# EAGLE design or-stm32-ds (EAGLE 6.2)
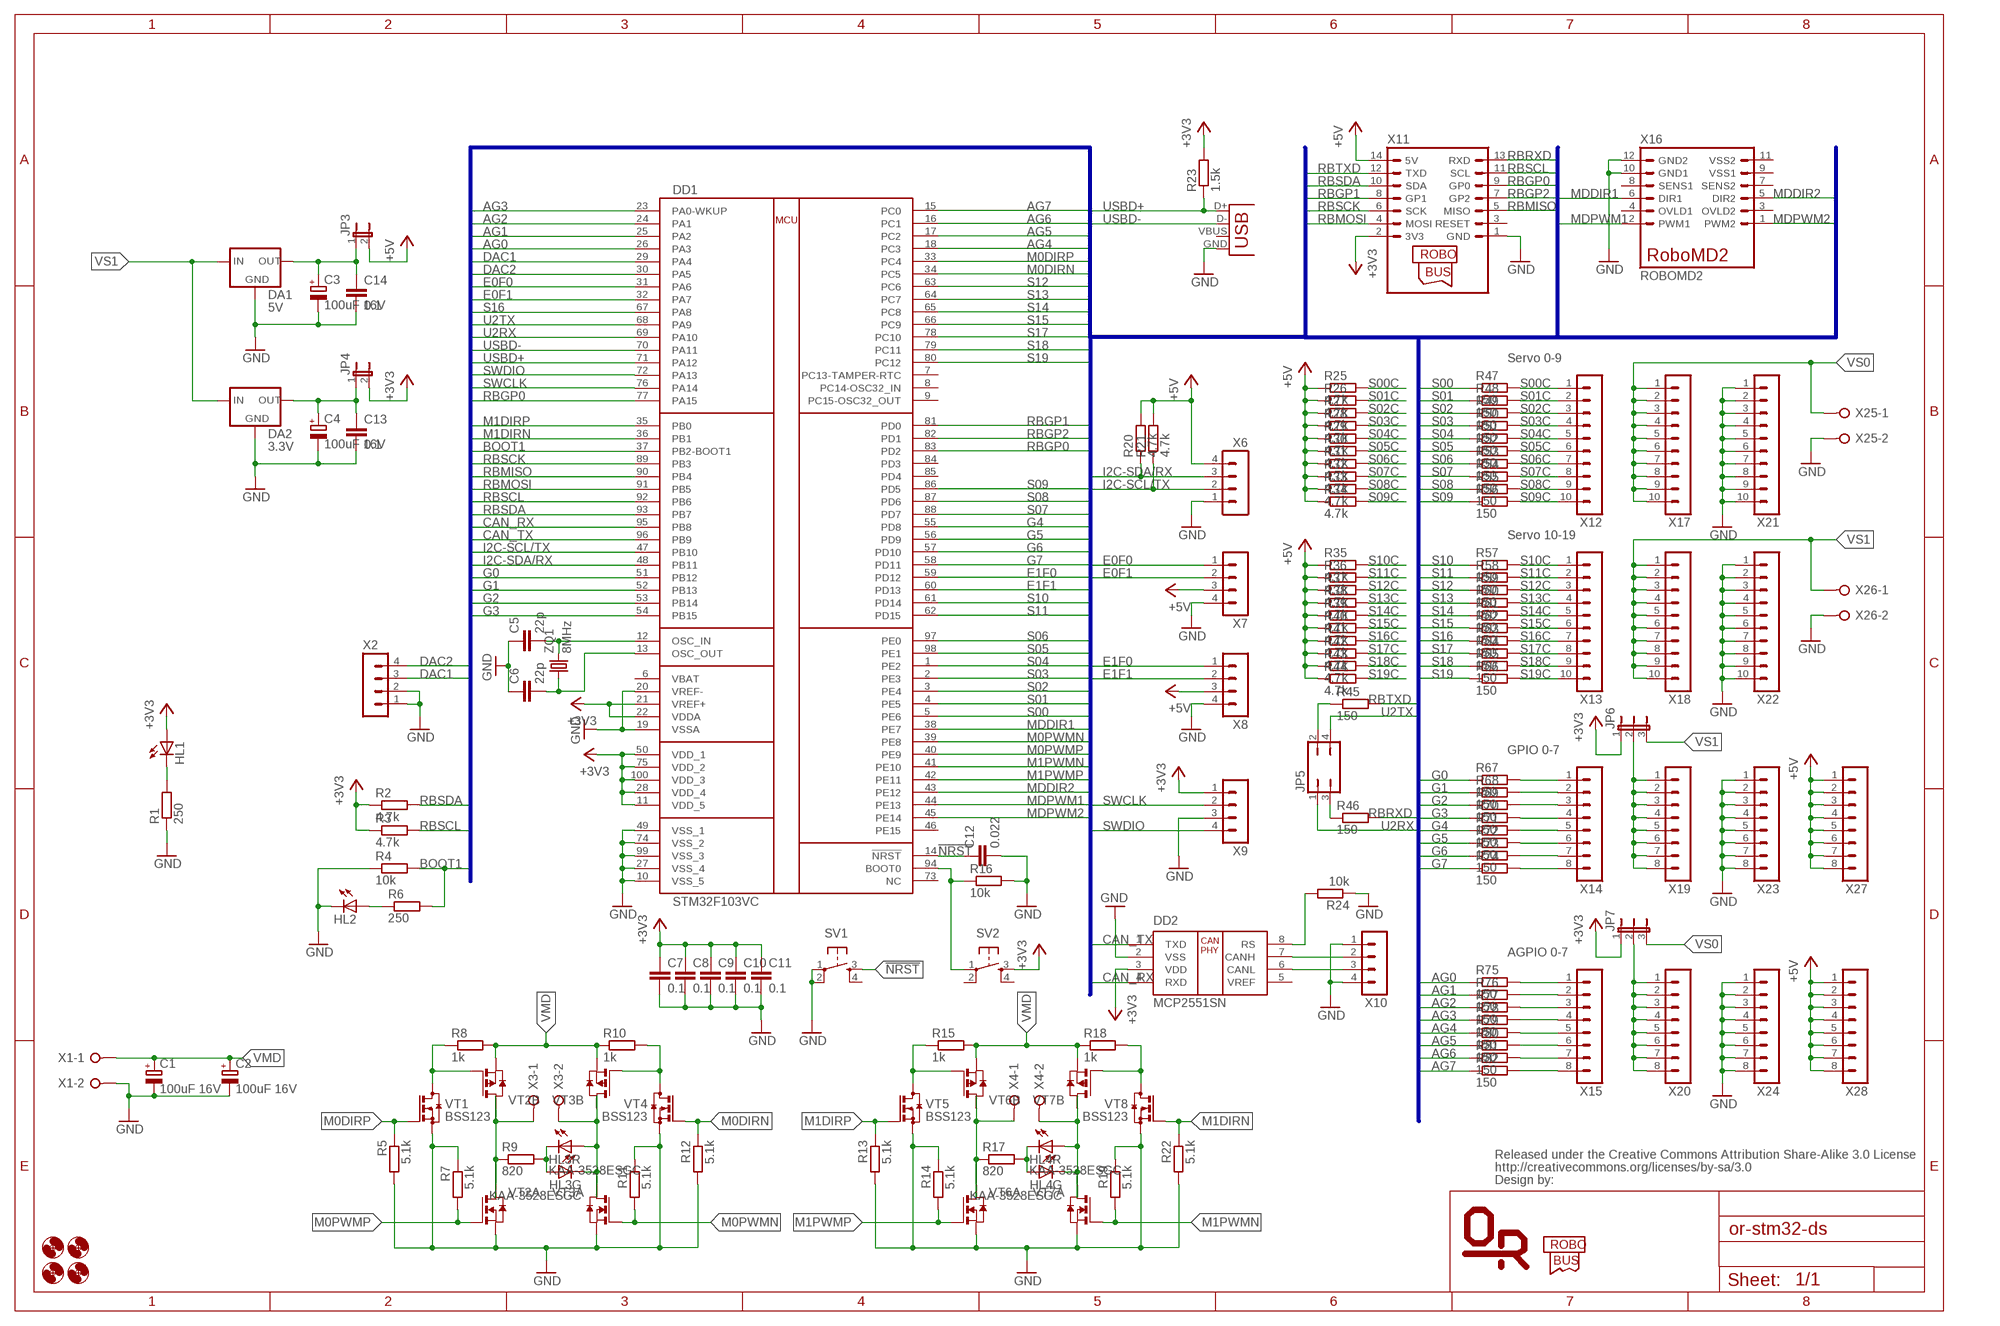
[diagram p0: schematic, sheet 1]

## Parts
C1  100uF 16V  CPOL-EUE3.5-8  [E3,5-8]
C2  100uF 16V  CPOL-EUE3.5-8  [E3,5-8]
C3  100uF 16V  CPOL-EUE3.5-8  [E3,5-8]
C4  100uF 16V  CPOL-EUE3.5-8  [E3,5-8]
C5  22p  C-EUC0603  [C0603]
C6  22p  C-EUC0603  [C0603]
C7  0.1  C-EUC0603  [C0603]
C8  0.1  C-EUC0603  [C0603]
C9  0.1  C-EUC0603  [C0603]
C10  0.1  C-EUC0603  [C0603]
C11  0.1  C-EUC0603  [C0603]
C12  0.022  C-EUC0603  [C0603]
C13  0.1  C-EUC0603  [C0603]
C14  0.1  C-EUC0603  [C0603]
DA1  5V  LM1117  [SOT223]
DA2  3.3V  LM1117  [SOT223]
DD1  STM32F103VC  [LQFP100]
DD2  MCP2551SN  [SO-08]
H1  MOUNT-HOLE3.2  [3,2]
H2  MOUNT-HOLE3.2  [3,2]
H3  MOUNT-HOLE3.2  [3,2]
H4  MOUNT-HOLE3.2  [3,2]
HL1  LEDCHIP-LED0805  [CHIP-LED0805]
HL2  LEDCHIP-LED0805  [CHIP-LED0805]
HL3  KAA-3528ESGC  [KA-3528]
HL4  KAA-3528ESGC  [KA-3528]
JP3  JP1E  [JP1]
JP4  JP1E  [JP1]
JP5  JP2Q  [JP2Q]
JP6  JP2E  [JP2]
JP7  JP2E  [JP2]
R1  250  R-EU_R0603  [R0603]
R2  4.7k  R-EU_R0603  [R0603]
R3  4.7k  R-EU_R0603  [R0603]
R4  10k  R-EU_R0603  [R0603]
R5  5.1k  R-EU_R0603  [R0603]
R6  250  R-EU_R0603  [R0603]
R7  5.1k  R-EU_R0603  [R0603]
R8  1k  R-EU_R0603  [R0603]
R9  820  R-EU_R0603  [R0603]
R10  1k  R-EU_R0603  [R0603]
R11  5.1k  R-EU_R0603  [R0603]
R12  5.1k  R-EU_R0603  [R0603]
R13  5.1k  R-EU_R0603  [R0603]
R14  5.1k  R-EU_R0603  [R0603]
R15  1k  R-EU_R0603  [R0603]
R16  10k  R-EU_R0603  [R0603]
R17  820  R-EU_R0603  [R0603]
R18  1k  R-EU_R0603  [R0603]
R19  5.1k  R-EU_R0603  [R0603]
R20  4.7k  R-EU_R0603  [R0603]
R21  4.7k  R-EU_R0603  [R0603]
R22  5.1k  R-EU_R0603  [R0603]
R23  1.5k  R-EU_R0603  [R0603]
R24  10k  R-EU_R0603  [R0603]
R25  4.7k  R-EU_R0603  [R0603]
R26  4.7k  R-EU_R0603  [R0603]
R27  4.7k  R-EU_R0603  [R0603]
R28  4.7k  R-EU_R0603  [R0603]
R29  4.7k  R-EU_R0603  [R0603]
R30  4.7k  R-EU_R0603  [R0603]
R31  4.7k  R-EU_R0603  [R0603]
R32  4.7k  R-EU_R0603  [R0603]
R33  4.7k  R-EU_R0603  [R0603]
R34  4.7k  R-EU_R0603  [R0603]
R35  4.7k  R-EU_R0603  [R0603]
R36  4.7k  R-EU_R0603  [R0603]
R37  4.7k  R-EU_R0603  [R0603]
R38  4.7k  R-EU_R0603  [R0603]
R39  4.7k  R-EU_R0603  [R0603]
R40  4.7k  R-EU_R0603  [R0603]
R41  4.7k  R-EU_R0603  [R0603]
R42  4.7k  R-EU_R0603  [R0603]
R43  4.7k  R-EU_R0603  [R0603]
R44  4.7k  R-EU_R0603  [R0603]
R45  150  R-EU_R0603  [R0603]
R46  150  R-EU_R0603  [R0603]
R47  150  R-EU_R0603  [R0603]
R48  150  R-EU_R0603  [R0603]
R49  150  R-EU_R0603  [R0603]
R50  150  R-EU_R0603  [R0603]
R51  150  R-EU_R0603  [R0603]
R52  150  R-EU_R0603  [R0603]
R53  150  R-EU_R0603  [R0603]
R54  150  R-EU_R0603  [R0603]
R55  150  R-EU_R0603  [R0603]
R56  150  R-EU_R0603  [R0603]
R57  150  R-EU_R0603  [R0603]
R58  150  R-EU_R0603  [R0603]
R59  150  R-EU_R0603  [R0603]
R60  150  R-EU_R0603  [R0603]
R61  150  R-EU_R0603  [R0603]
R62  150  R-EU_R0603  [R0603]
R63  150  R-EU_R0603  [R0603]
R64  150  R-EU_R0603  [R0603]
R65  150  R-EU_R0603  [R0603]
R66  150  R-EU_R0603  [R0603]
R67  150  R-EU_R0603  [R0603]
R68  150  R-EU_R0603  [R0603]
R69  150  R-EU_R0603  [R0603]
R70  150  R-EU_R0603  [R0603]
R71  150  R-EU_R0603  [R0603]
R72  150  R-EU_R0603  [R0603]
R73  150  R-EU_R0603  [R0603]
R74  150  R-EU_R0603  [R0603]
R75  150  R-EU_R0603  [R0603]
R76  150  R-EU_R0603  [R0603]
R77  150  R-EU_R0603  [R0603]
R78  150  R-EU_R0603  [R0603]
R79  150  R-EU_R0603  [R0603]
R80  150  R-EU_R0603  [R0603]
R81  150  R-EU_R0603  [R0603]
R82  150  R-EU_R0603  [R0603]
SV1  TAC_SWITCHSMD  [TACTILE_SWITCH_SMD]
SV2  TAC_SWITCHSMD  [TACTILE_SWITCH_SMD]
U$1  CREATIVE_COMMONS_BY-SA  [CC-BY-SA-6MM]
U$2  ORLOGO  [ORLOGO]
U$3  ROBOBUS_LOGO  [ROBOBUS_LOGO]
VT1  BSS123  [SOT23]
VT2  PN_MOSFET-SO8  [SO8]
VT3  PN_MOSFET-SO8  [SO8]
VT4  BSS123  [SOT23]
VT5  BSS123  [SOT23]
VT6  PN_MOSFET-SO8  [SO8]
VT7  PN_MOSFET-SO8  [SO8]
VT8  BSS123  [SOT23]
X1  HT396R-02P  [HT396R-02P]
X2  MA04-11.27MM  [1X04-1.27MM]
X3  HT396R-02P  [HT396R-02P]
X4  HT396R-02P  [HT396R-02P]
X5  USBSMD  [USB-MINIB]
X6  MA04-1  [MA04-1]
X7  MA04-1  [MA04-1]
X8  MA04-1  [MA04-1]
X9  MA04-11.27MM  [1X04-1.27MM]
X10  MA04-1  [MA04-1]
X11  ROBOBUSR  [ML14L]
X12  MA10-1  [MA10-1]
X13  MA10-1  [MA10-1]
X14  MA08-1  [MA08-1]
X15  MA08-1  [MA08-1]
X16  ROBOMD2  [ML12]
X17  MA10-1  [MA10-1]
X18  MA10-1  [MA10-1]
X19  MA08-1  [MA08-1]
X20  MA08-1  [MA08-1]
X21  MA10-1  [MA10-1]
X22  MA10-1  [MA10-1]
X23  MA08-1  [MA08-1]
X24  MA08-1  [MA08-1]
X25  W237-02P  [W237-132]
X26  W237-02P  [W237-132]
X27  MA08-1  [MA08-1]
X28  MA08-1  [MA08-1]
ZQ1  8MHz  CRYSTALHC49U-V  [HC49U-V]

## Nets
!NRST: C12.1 DD1.14(!NRST) SV1.3
+3V3: C7.1 C8.1 C9.1 C10.1 C11.1 DD1.11(VDD_5) DD1.21(VREF+) DD1.22(VDDA) DD1.28(VDD_4) DD1.50(VDD_1) DD1.75(VDD_2) DD1.100(VDD_3) DD2.3(VDD) HL1.A JP4.2 JP6.1 JP7.1 R2.1 R3.1 R23.2 SV2.3 X9.1 X11.2(3V3)
+5V: JP3.2 R20.2 R21.2 R25.1 R26.1 R27.1 R28.1 R29.1 R30.1 R31.1 R32.1 R33.1 R34.1 R35.1 R36.1 R37.1 R38.1 R39.1 R40.1 R41.1 R42.1 R43.1 R44.1 X6.4 X7.3 X8.3 X11.14(5V) X27.1 X27.2 X27.3 X27.4 X27.5 X27.6 X27.7 X27.8 X28.1 X28.2 X28.3 X28.4 X28.5 X28.6 X28.7 X28.8
AG0: DD1.26(PA3) R75.1
AG0C: R75.2 X15.1
AG1: DD1.25(PA2) R76.1
AG1C: R76.2 X15.2
AG2: DD1.24(PA1) R77.1
AG2C: R77.2 X15.3
AG3: DD1.23(PA0-WKUP) R78.1
AG3C: R78.2 X15.4
AG4: DD1.18(PC3) R79.1
AG4C: R79.2 X15.5
AG5: DD1.17(PC2) R80.1
AG5C: R80.2 X15.6
AG6: DD1.16(PC1) R81.1
AG6C: R81.2 X15.7
AG7: DD1.15(PC0) R82.1
AG7C: R82.2 X15.8
BOOT0: DD1.94(BOOT0) R16.1 SV2.1
BOOT1: DD1.37(PB2-BOOT1) R4.2 R6.2
CAN_RX: DD1.95(PB8) DD2.4(RXD)
CAN_TX: DD1.96(PB9) DD2.1(TXD)
CANH: DD2.7(CANH) X10.2
CANL: DD2.6(CANL) X10.3
CANRS: DD2.8(RS) R24.2
DAC1: DD1.29(PA4) X2.3
DAC2: DD1.30(PA5) X2.4
E0F0: DD1.31(PA6) X7.1
E0F1: DD1.32(PA7) X7.2
E1F0: DD1.59(PD12) X8.1
E1F1: DD1.60(PD13) X8.2
G0: DD1.51(PB12) R67.1
G0C: R67.2 X14.1
G1: DD1.52(PB13) R68.1
G1C: R68.2 X14.2
G2: DD1.53(PB14) R69.1
G2C: R69.2 X14.3
G3: DD1.54(PB15) R70.1
G3C: R70.2 X14.4
G4: DD1.55(PD8) R71.1
G4C: R71.2 X14.5
G5: DD1.56(PD9) R72.1
G5C: R72.2 X14.6
G6: DD1.57(PD10) R73.1
G6C: R73.2 X14.7
G7: DD1.58(PD11) R74.1
G7C: R74.2 X14.8
GND: C1.- C2.- C3.- C4.- C5.1 C6.1 C7.2 C8.2 C9.2 C10.2 C11.2 C12.2 C13.2 C14.2 DA1.1(GND) DA2.1(GND) DD1.10(VSS_5) DD1.19(VSSA) DD1.20(VREF-) DD1.27(VSS_4) DD1.49(VSS_1) DD1.74(VSS_2) DD1.99(VSS_3) DD2.2(VSS) HL2.C R1.1 R4.1 R5.2 R7.1 R11.1 R12.2 R13.2 R14.1 R16.2 R19.1 R22.2 R24.1 SV1.1 SV1.2 VT1.2(S) VT2.1(A:S) VT3.1(A:S) VT4.2(S) VT5.2(S) VT6.1(A:S) VT7.1(A:S) VT8.2(S) X1.2 X2.1 X2.2 X5.GND X6.1 X7.4 X8.4 X9.3 X10.1 X10.4 X11.1(GND) X16.10(GND1) X16.12(GND2) X21.1 X21.2 X21.3 X21.4 X21.5 X21.6 X21.7 X21.8 X21.9 X21.10 X22.1 X22.2 X22.3 X22.4 X22.5 X22.6 X22.7 X22.8 X22.9 X22.10 X23.1 X23.2 X23.3 X23.4 X23.5 X23.6 X23.7 X23.8 X24.1 X24.2 X24.3 X24.4 X24.5 X24.6 X24.7 X24.8 X25.2 X26.2
GPVCC: JP6.2 X19.1 X19.2 X19.3 X19.4 X19.5 X19.6 X19.7 X19.8
I2C-SCL/TX: DD1.47(PB10) R21.1 X6.2
I2C-SDA/RX: DD1.48(PB11) R20.1 X6.3
M0C+: R9.1 VT2.5(B:D) VT2.6(B:D2) VT2.7(A:D) VT2.8(A:D2) X3.1
M0C+1: R17.1 VT6.5(B:D) VT6.6(B:D2) VT6.7(A:D) VT6.8(A:D2) X4.1
M0C-: HL3.2(R:A) HL3.3(G:C) VT3.5(B:D) VT3.6(B:D2) VT3.7(A:D) VT3.8(A:D2) X3.2
M0C-1: HL4.2(R:A) HL4.3(G:C) VT7.5(B:D) VT7.6(B:D2) VT7.7(A:D) VT7.8(A:D2) X4.2
M0DIRN: DD1.34(PC5) R12.1 VT4.1(G)
M0DIRP: DD1.33(PC4) R5.1 VT1.1(G)
M0PWMN: DD1.39(PE8) R11.2 VT3.2(A:G)
M0PWMP: DD1.40(PE9) R7.2 VT2.2(A:G)
M1DIRN: DD1.36(PB1) R22.1 VT8.1(G)
M1DIRP: DD1.35(PB0) R13.1 VT5.1(G)
M1PWMN: DD1.41(PE10) R19.2 VT7.2(A:G)
M1PWMP: DD1.42(PE11) R14.2 VT6.2(A:G)
MDDIR1: DD1.38(PE7) X16.6(DIR1)
MDDIR2: DD1.43(PE12) X16.5(DIR2)
MDPWM1: DD1.44(PE13) X16.2(PWM1)
MDPWM2: DD1.45(PE14) X16.1(PWM2)
N$1: JP5.3 R46.1
N$2: C5.2 DD1.12(OSC_IN) ZQ1.2
N$3: C6.2 DD1.13(OSC_OUT) ZQ1.1
N$4: JP7.2 X20.1 X20.2 X20.3 X20.4 X20.5 X20.6 X20.7 X20.8
N$5: JP5.2 R45.1
N$6: HL1.C R1.2
N$7: HL2.A R6.1
N$8: R8.1 VT1.3(D) VT2.4(B:G)
N$9: R10.2 VT3.4(B:G) VT4.3(D)
N$10: HL3.1(R:C) HL3.4(G:A) R9.2
N$11: R15.1 VT5.3(D) VT6.4(B:G)
N$12: R18.2 VT7.4(B:G) VT8.3(D)
N$13: HL4.1(R:C) HL4.4(G:A) R17.2
RBGP0: DD1.77(PA15) DD1.83(PD2) X11.9(GP0)
RBGP1: DD1.81(PD0) X11.8(GP1)
RBGP2: DD1.82(PD1) X11.7(GP2)
RBMISO: DD1.90(PB4) X11.5(MISO)
RBMOSI: DD1.91(PB5) X11.4(MOSI)
RBRXD: R46.2 X11.13(RXD)
RBSCK: DD1.89(PB3) X11.6(SCK)
RBSCL: DD1.92(PB6) R3.2 X11.11(SCL)
RBSDA: DD1.93(PB7) R2.2 X11.10(SDA)
RBTXD: R45.2 X11.12(TXD)
S00: DD1.5(PE6) R47.1
S00C: R25.2 R47.2 X12.1
S01: DD1.4(PE5) R48.1
S01C: R26.2 R48.2 X12.2
S02: DD1.3(PE4) R49.1
S02C: R27.2 R49.2 X12.3
S03: DD1.2(PE3) R50.1
S03C: R28.2 R50.2 X12.4
S04: DD1.1(PE2) R51.1
S04C: R29.2 R51.2 X12.5
S05: DD1.98(PE1) R52.1
S05C: R30.2 R52.2 X12.6
S06: DD1.97(PE0) R53.1
S06C: R31.2 R53.2 X12.7
S07: DD1.88(PD7) R54.1
S07C: R32.2 R54.2 X12.8
S08: DD1.87(PD6) R55.1
S08C: R33.2 R55.2 X12.9
S09: DD1.86(PD5) R56.1
S09C: R34.2 R56.2 X12.10
S10: DD1.61(PD14) R57.1
S10C: R35.2 R57.2 X13.1
S11: DD1.62(PD15) R58.1
S11C: R36.2 R58.2 X13.2
S12: DD1.63(PC6) R59.1
S12C: R37.2 R59.2 X13.3
S13: DD1.64(PC7) R60.1
S13C: R38.2 R60.2 X13.4
S14: DD1.65(PC8) R61.1
S14C: R39.2 R61.2 X13.5
S15: DD1.66(PC9) R62.1
S15C: R40.2 R62.2 X13.6
S16: DD1.67(PA8) R63.1
S16C: R41.2 R63.2 X13.7
S17: DD1.78(PC10) R64.1
S17C: R42.2 R64.2 X13.8
S18: DD1.79(PC11) R65.1
S18C: R43.2 R65.2 X13.9
S19: DD1.80(PC12) R66.1
S19C: R44.2 R66.2 X13.10
SWCLK: DD1.76(PA14) X9.2
SWDIO: DD1.72(PA13) X9.4
U2RX: DD1.69(PA10) JP5.1
U2TX: DD1.68(PA9) JP5.4
USBD+: DD1.71(PA12) R23.1 X5.D+
USBD-: DD1.70(PA11) X5.D-
VMD: C1.+ C2.+ R8.2 R10.1 R15.2 R18.1 VT2.3(B:S) VT3.3(B:S) VT6.3(B:S) VT7.3(B:S) X1.1
VREG5: C3.+ C14.1 DA1.2(OUT) JP3.1
VREG33: C4.+ C13.1 DA2.2(OUT) JP4.1
VS0: JP7.3 X17.1 X17.2 X17.3 X17.4 X17.5 X17.6 X17.7 X17.8 X17.9 X17.10 X25.1
VS1: DA1.3(IN) DA2.3(IN) JP6.3 X18.1 X18.2 X18.3 X18.4 X18.5 X18.6 X18.7 X18.8 X18.9 X18.10 X26.1
Unconnected: DD1.6(VBAT) DD1.7(PC13-TAMPER-RTC) DD1.8(PC14-OSC32_IN) DD1.9(PC15-OSC32_OUT) DD1.46(PE15) DD1.73(NC) DD1.84(PD3) DD1.85(PD4) SV1.4 SV2.2 SV2.4 X5.VBUS X11.3(RESET) X16.3(OVLD2) X16.4(OVLD1) X16.7(SENS2) X16.8(SENS1) X16.9(VSS1) X16.11(VSS2)

## Buses
S00,S01,S02,S03,S04,S05,S06,S07,S08,S09,S10,S11,S12,S13,S14,S15,S16,S17,S18,S19,RBTXD,RBRXD,RBSCL,RBSDA,RBGP0,RBGP1,RBGP2,RBSCK,RBMISO,RBMOSI,MDSENS1,MDSENS2,MDDIR1,MDDIR2,MDOVLD1,MDOVLD2,MDPWM1,MDPWM2,G0,G1,G2,G3,G4,G5,G6,G7,AG0,AG1,AG2,AG3,AG4,AG5,AG6,AG7,U2TX,U2RX,USBD+,USBD-,I2C-SCL/TX,I2C-SDA/RX,E0F0,E0F1,E1F0,E1F1,SWDIO,SWCLK,CAN_TX,CAN_RX,M0DIRP,M0DIRN,M0PWMP,M0PWMN,M1DIRP,M1DIRN,M1PWMP,M1PWMN,BOOT1,DAC1,DAC2

## Notes on the sheet
- Servo 0-9
- Servo 10-19
- GPIO 0-7
- AGPIO 0-7

## Power pins joined to a net without a drawn wire
VREF: DD2.5(VREF)

## Library data of the parts
C1-C4 = rcl:CPOL-EU: POLARIZED CAPACITOR, European symbol
C5-C14 = rcl:C-EU: CAPACITOR, European symbol
DA1 DA2 = v-reg-3:LM1117
DD1 = stm32f103:STM32F103: Cortex-M3 microcontroller STMicroelectronics STM32F103VC
DD2 = can:MCP2551: High Speed CAN tranceiver
H1-H4 = holes:MOUNT-HOLE: MOUNTING HOLE with drill center marker
HL1 HL2 = led:LED: LED OSRAM: - CHIPLED LG R971, LG N971, LY N971, LG Q971, LY Q971, LO R971, LY R971 LH N974, LH R974 LS Q976, LO Q976, LY Q976 LO Q996 - Hyper CHIPLED LW Q18S LB Q993, LB Q99A, LB R99A - SideLED LS A670, LO A670, LY A670, LG A670, LP A670 LB A673, LV A673, LT A673, LW A673 LH A674 LY A675 LS A676, LA A676, LO A676, LY A676, LW A676 LS A679, LY A679, LG A679 - Hyper Micro SIDELED® LS Y876, LA Y876, LO Y876, LY Y876 LT Y87S - SmartLED LW L88C, LW L88S LB L89C, LB L89S, LG L890 LS L89K, LO L89K, LY L89K LS L896, LA L896, LO L896, LY L896 - TOPLED LS T670, LO T670, LY T670, LG T670, LP T670 LSG T670, LSP T670, LSY T670, LOP T670, LYG T670 LG T671, LOG T671, LSG T671 LB T673, LV T673, LT T673, LW T673 LH T674 LS T676, LA T676, LO T676, LY T676, LB T676, LH T676, LSB T676, LW T676 LB T67C, LV T67C, LT T67C, LS T67K, LO T67K, LY T67K, LW E67C LS E67B, LA E67B, LO E67B, LY E67B, LB E67C, LV E67C, LT E67C LW T67C LS T679, LY T679, LG T679 LS T770, LO T770, LY T770, LG T770, LP T770 LB T773, LV T773, LT T773, LW T773 LH T774 LS E675, LA E675, LY E675, LS T675 LS T776, LA T776, LO T776, LY T776, LB T776 LHGB T686 LT T68C, LB T68C - Hyper Mini TOPLED® LB M676 - Mini TOPLED Santana® LG M470 LS M47K, LO M47K, LY M47K Source: http://www.osram.convergy.de LUXEON: - LUMILED® LXK2-PW12-R00, LXK2-PW12-S00, LXK2-PW14-U00, LXK2-PW14-V00 LXK2-PM12-R00, LXK2-PM12-S00, LXK2-PM14-U00 LXK2-PE12-Q00, LXK2-PE12-R00, LXK2-PE12-S00, LXK2-PE14-T00, LXK2-PE14-U00 LXK2-PB12-K00, LXK2-PB12-L00, LXK2-PB12-M00, LXK2-PB14-N00, LXK2-PB14-P00, LXK2-PB14-Q00 LXK2-PR12-L00, LXK2-PR12-M00, LXK2-PR14-Q00, LXK2-PR14-R00 LXK2-PD12-Q00, LXK2-PD12-R00, LXK2-PD12-S00 LXK2-PH12-R00, LXK2-PH12-S00 LXK2-PL12-P00, LXK2-PL12-Q00, LXK2-PL12-R00 Source: www.luxeon.com KINGBRIGHT: KA-3528ASYC Source: www.kingbright.com
HL3 HL4 = led2:KAA-3528ESGC: KAA-3528ESGC Kingbright® 3.5x2.8mm SURFACE MOUNT LED LAMPS
JP3 JP4 = con-std:JP1E: JUMPER
JP5 = jumper:JP2Q: JUMPER
JP6 JP7 = con-std:JP2E: JUMPER
R1-R82 = rcl:R-EU_: RESISTOR, European symbol
SV1 SV2 = SparkFun:TAC_SWITCH: Momentary Switch Button commonly used for reset or general input. Spark Fun Electronics SKU : COM-00097
U$1 = logo:CREATIVE_COMMONS_BY-SA; AUTHOR: Open Robotics Team
U$2 = OpenRobotics:ORLOGO
U$3 = OpenRobotics:ROBOBUS_LOGO
VT1 VT4 VT5 VT8 = transistor-small-signal:BSS123: N-CHANNEL MOS FET
VT2 VT3 VT6 VT7 = zetex:PN_MOSFET-: DUAL N AND P-CHANNEL ENHANCEMENT MODE MOSFET source ZXMD63C02.pdf from http://www.zetex.com/; OC_FARNELL: unknown; OC_NEWARK: unknown
X1 X3 X4 = con-std:HT396R-02P: SREW CLAMP 3.96 mm; OC_FARNELL: unknown; OC_NEWARK: unknown
X2 X9 = con-std:MA04-1: PIN HEADER
X5 = SparkFun:USB: USB Connectors USB-B-PTH is fully proven SKU : PRT-00139 USB-miniB is fully proven SKU : PRT-00587 USB-A-PCB is untested. USB-A-H is throughly reviewed, but untested. Spark Fun Electronics SKU : PRT-00437 USB-B-SMT is throughly reviewed, but untested. Needs silkscreen touching up. USB-A-S has not been used/tested USB-MB-H has not been used/tested
X6-X8 X10 = con-std:MA04-1: PIN HEADER; OC_FARNELL: unknown; OC_NEWARK: unknown
X11 = robobus:ROBOBUS
X12 X13 X17 X18 X21 X22 = con-std:MA10-1: PIN HEADER; OC_FARNELL: unknown; OC_NEWARK: unknown
X14 X15 X19 X20 X23 X24 X27 X28 = con-std:MA08-1: PIN HEADER; OC_FARNELL: unknown; OC_NEWARK: unknown
X16 = robobus:ROBOMD2: ROBOMD2 Connector for exhernal dual channel brushed motor driver.
X25 X26 = con-std:W237-02P: WAGO SREW CLAMP; OC_FARNELL: unknown; OC_NEWARK: unknown
ZQ1 = crystal:CRYSTAL: CRYSTAL; OC_FARNELL: 1666969; OC_NEWARK: unknown

## Board
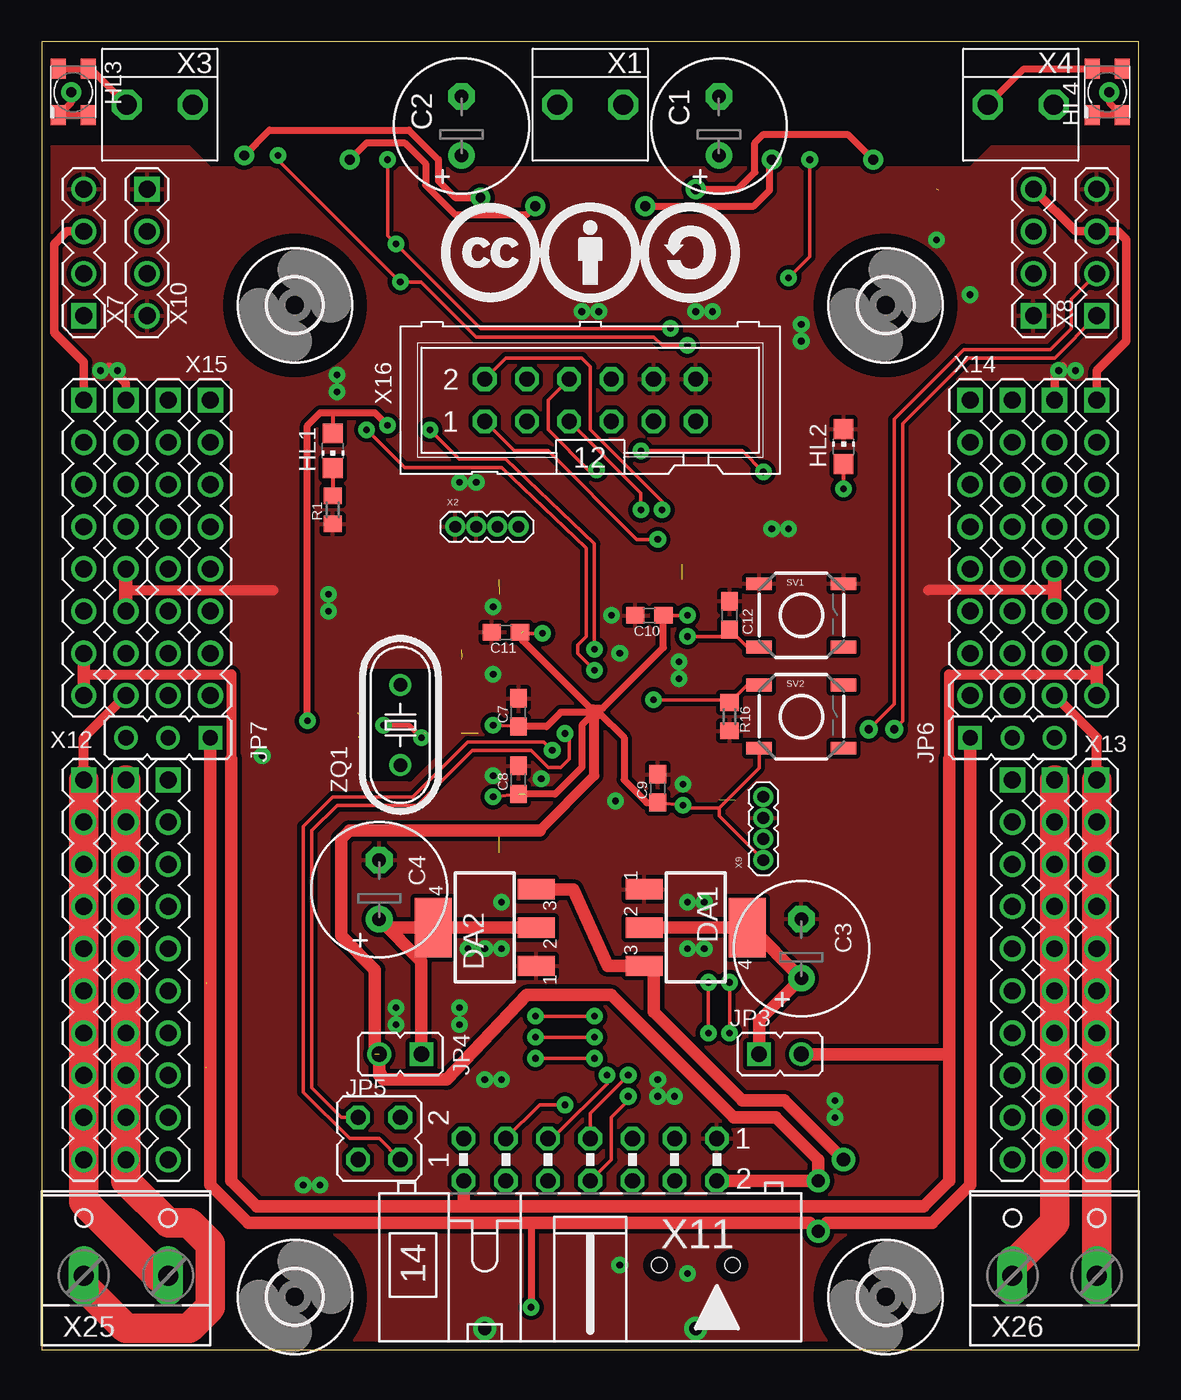
[diagram p1: board, top side]
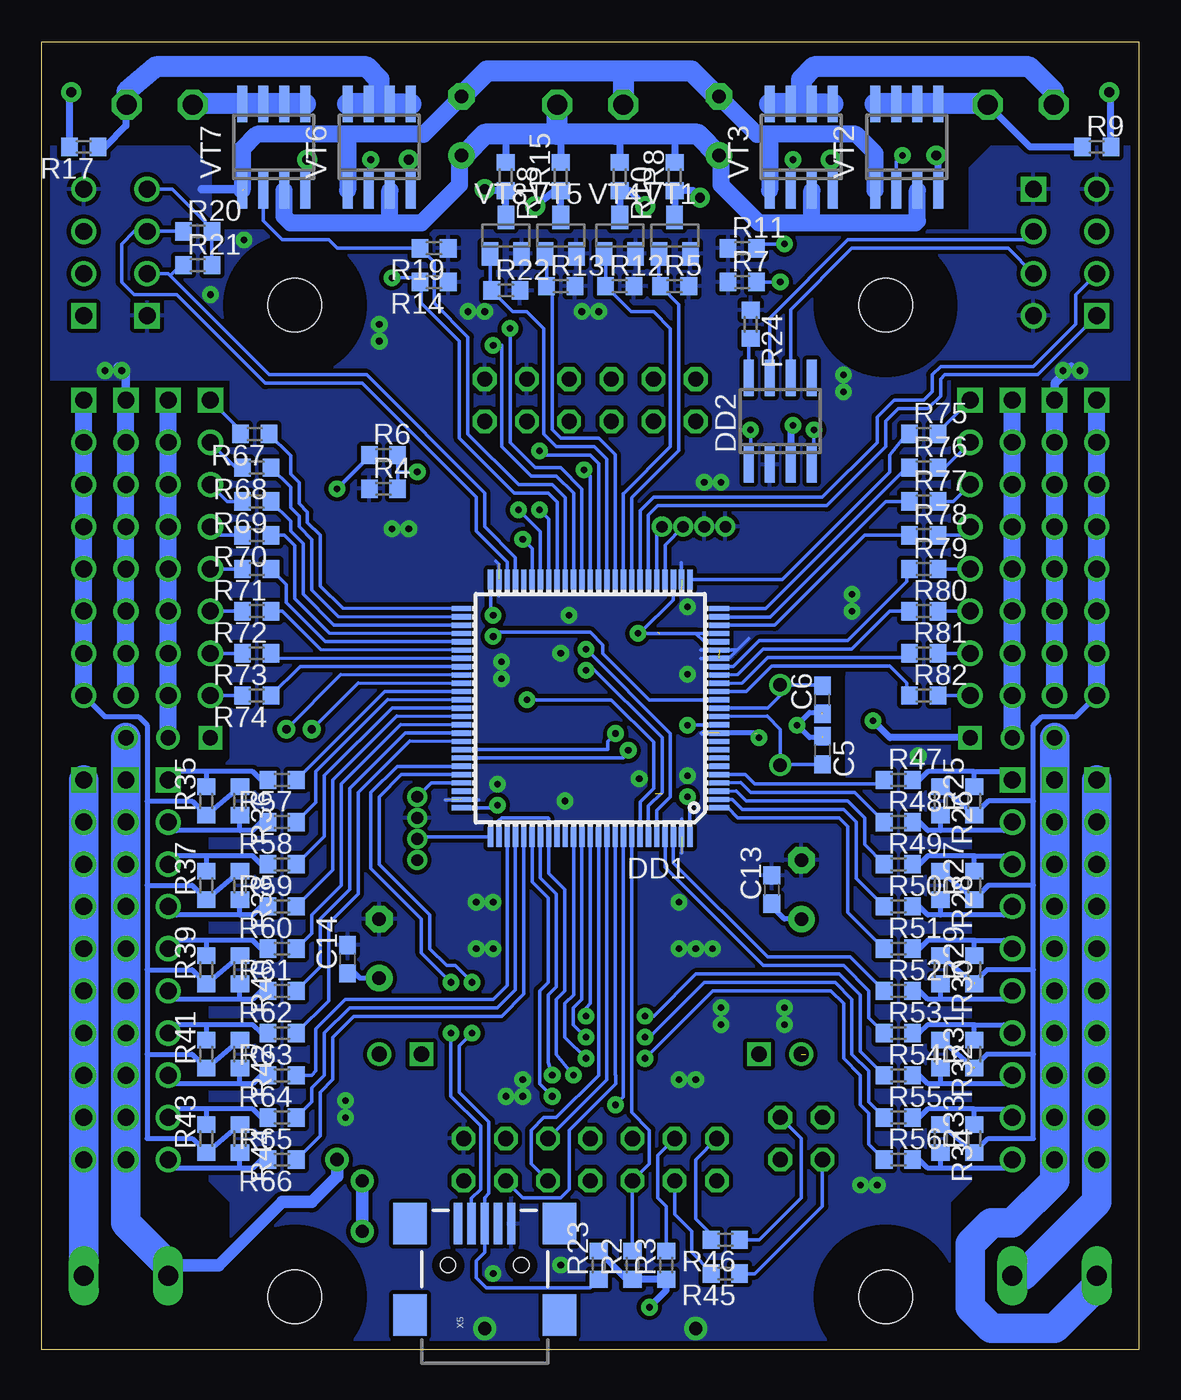
[diagram p2: board, bottom side, seen from below]

Size 66.04 x 78.74 mm. Coordinates in mm from the lower left corner, seen from the top.
Outline: 0,0 66.04,0 66.04,78.74 0,78.74 0,0
Copper layers (1*16): Top 0.018mm / dielectric 1.5mm / Bottom 0.018mm
Design rules: minimum track width 0.2mm, minimum drill 0.4mm, track to track 0.2mm, track to pad 0.2mm, pad to pad 0.2mm, via to via 0.2mm, smd to smd 0.2mm, copper to edge 20mil, drill to drill 8mil, minimum pad ring 10mil, minimum via ring 0.3mm, stop-mask expansion 4mil, vias tented up to drill 0mil, thermal gap 10mil
tRestrict: area 19.8,34.5 to 23.4,40.6
bRestrict: area 18,34.5 to 24.1,40.6; 1 lines

### Footprints (pad centres in the part's own frame; a part is rotated, then mirrored left to right if it is on the bottom)
E3,5-8 = drill 0.813 pad 1.6: + -1.778,0 | drill 0.813 pad 1.6 octagon: - 1.778,0
C0603 = smd 1.1 x 1: 1 -0.85,0; 2 0.85,0
SOT223 = smd 1.219 x 2.235: 1 -2.311,-3.099; 2 0,-3.099; 3 2.311,-3.099 | smd 3.6 x 2.2: 4 0,3.099
LQFP100 = smd 1.2 x 0.32: 1 -7.75,6; 2 -7.75,5.5; 3 -7.75,5; 4 -7.75,4.5; 5 -7.75,4; 6 -7.75,3.5; 7 -7.75,3; 8 -7.75,2.5; 9 -7.75,2; 10 -7.75,1.5; 11 -7.75,1; 12 -7.75,0.5; 13 -7.75,0; 14 -7.75,-0.5; 15 -7.75,-1; 16 -7.75,-1.5; 17 -7.75,-2; 18 -7.75,-2.5; 19 -7.75,-3; 20 -7.75,-3.5; 21 -7.75,-4; 22 -7.75,-4.5; 23 -7.75,-5; 24 -7.75,-5.5; 25 -7.75,-6; 51 7.75,-6; 52 7.75,-5.5; 53 7.75,-5; 54 7.75,-4.5; 55 7.75,-4; 56 7.75,-3.5; 57 7.75,-3; 58 7.75,-2.5; 59 7.75,-2; 60 7.75,-1.5; 61 7.75,-1; 62 7.75,-0.5; 63 7.75,0; 64 7.75,0.5; 65 7.75,1; 66 7.75,1.5; 67 7.75,2; 68 7.75,2.5; 69 7.75,3; 70 7.75,3.5; 71 7.75,4; 72 7.75,4.5; 73 7.75,5; 74 7.75,5.5; 75 7.75,6 | smd 0.32 x 1.2: 26 -6,-7.75; 27 -5.5,-7.75; 28 -5,-7.75; 29 -4.5,-7.75; 30 -4,-7.75; 31 -3.5,-7.75; 32 -3,-7.75; 33 -2.5,-7.75; 34 -2,-7.75; 35 -1.5,-7.75; 36 -1,-7.75; 37 -0.5,-7.75; 38 0,-7.75; 39 0.5,-7.75; 40 1,-7.75; 41 1.5,-7.75; 42 2,-7.75; 43 2.5,-7.75; 44 3,-7.75; 45 3.5,-7.75; 46 4,-7.75; 47 4.5,-7.75; 48 5,-7.75; 49 5.5,-7.75; 50 6,-7.75; 76 6,7.75; 77 5.5,7.75; 78 5,7.75; 79 4.5,7.75; 80 4,7.75; 81 3.5,7.75; 82 3,7.75; 83 2.5,7.75; 84 2,7.75; 85 1.5,7.75; 86 1,7.75; 87 0.5,7.75; 88 0,7.75; 89 -0.5,7.75; 90 -1,7.75; 91 -1.5,7.75; 92 -2,7.75; 93 -2.5,7.75; 94 -3,7.75; 95 -3.5,7.75; 96 -4,7.75; 97 -4.5,7.75; 98 -5,7.75; 99 -5.5,7.75; 100 -6,7.75
SO-08 = smd 0.6 x 2.2: 1 -1.905,-2.6; 2 -0.635,-2.6; 3 0.635,-2.6; 4 1.905,-2.6; 5 1.905,2.6; 6 0.635,2.6; 7 -0.635,2.6; 8 -1.905,2.6
3,2 = hole 3.2: 0,0
CHIP-LED0805 = smd 1.2 x 1.2: A 0,-1.05; C 0,1.05
KA-3528 = smd 1.2 x 0.9: 1 1.4,-0.9; 2 -1.4,-0.9; 3 -1.4,0.9; 4 1.4,0.9
JP1 = drill 0.914 square: 1 0,-1.27 | drill 0.914: 2 0,1.27
JP2Q = drill 0.914 octagon: 1 -1.27,-1.27; 2 -1.27,1.27; 3 1.27,-1.27; 4 1.27,1.27
JP2 = drill 0.914 square: 1 -2.54,0 | drill 0.914: 2 0,0; 3 2.54,0
R0603 = smd 1 x 1.1: 1 -0.85,0; 2 0.85,0
TACTILE_SWITCH_SMD = smd 1.524 x 0.762: 1 -2.54,1.905; 2 2.54,1.905; 3 -2.54,-1.905; 4 2.54,-1.905
SOT23 = smd 1 x 1.4: 1 -0.95,-1.1; 2 0.95,-1.1; 3 0,1.1
SO8 = smd 0.6 x 2.2: 1 -1.905,-2.6; 2 -0.635,-2.6; 3 0.635,-2.6; 4 1.905,-2.6; 5 1.905,2.6; 6 0.635,2.6; 7 -0.635,2.6; 8 -1.905,2.6
HT396R-02P = drill 1.194 octagon: 1 -1.981,0; 2 1.981,0
1X04-1.27MM = drill 0.7 pad 1: 1 0,0; 2 1.27,0; 3 2.54,0; 4 3.81,0
USB-MINIB = smd 2.5 x 0.5: D+ 2.5,0; D- 2.5,0.8; GND 2.5,-1.6; ID 2.5,-0.8; VBUS 2.5,1.6 | smd 2.5 x 2: GND@1 -3,-4.5; GND@2 -3,4.5; GND@3 2.5,4.5; GND@4 2.5,-4.5 | hole 0.9: 0,2.2; 0,-2.2
MA04-1 = drill 1.016 square: 1 -3.81,0 | drill 1.016: 2 -1.27,0; 3 1.27,0; 4 3.81,0
ML14L = drill 0.914 octagon: 1 -7.62,-1.27; 2 -7.62,1.27; 3 -5.08,-1.27; 4 -5.08,1.27; 5 -2.54,-1.27; 6 -2.54,1.27; 7 0,-1.27; 8 0,1.27; 9 2.54,-1.27; 10 2.54,1.27; 11 5.08,-1.27; 12 5.08,1.27; 13 7.62,-1.27; 14 7.62,1.27
MA10-1 = drill 1.016 square: 1 -11.43,0 | drill 1.016: 2 -8.89,0; 3 -6.35,0; 4 -3.81,0; 5 -1.27,0; 6 1.27,0; 7 3.81,0; 8 6.35,0; 9 8.89,0; 10 11.43,0
MA08-1 = drill 1.016 square: 1 -8.89,0 | drill 1.016: 2 -6.35,0; 3 -3.81,0; 4 -1.27,0; 5 1.27,0; 6 3.81,0; 7 6.35,0; 8 8.89,0
ML12 = drill 0.914 octagon: 1 -6.35,-1.27; 2 -6.35,1.27; 3 -3.81,-1.27; 4 -3.81,1.27; 5 -1.27,-1.27; 6 -1.27,1.27; 7 1.27,-1.27; 8 1.27,1.27; 9 3.81,-1.27; 10 3.81,1.27; 11 6.35,-1.27; 12 6.35,1.27
W237-132 = drill 1.194 long: 1 -2.54,-0.635; 2 2.54,-0.635
HC49U-V = drill 0.813: 1 -2.413,0; 2 2.413,0

### Placement (x,y rotation side)
C1  40.77,73.66 90 top
C2  25.27,73.66 90 top
C3  45.72,24.13 90 top
C4  20.32,27.69 90 top
C5  19.05,36.07 270 bottom
C6  19.05,39.12 90 bottom
C7  28.7,38.35 90 top
C8  28.7,34.29 90 top
C9  37.08,33.78 90 top
C10  36.58,44.2 180 top
C11  27.94,43.18 180 top
C12  41.4,44.2 90 top
C13  22.1,27.69 90 bottom
C14  47.62,23.5 90 bottom
DA1  39.37,25.4 270 top
DA2  26.67,25.4 90 top
DD1  33.02,38.61 180 bottom
DD2  21.59,55.88 0 bottom
H1  15.24,3.17 0 top
H2  50.8,3.17 0 top
H3  15.24,62.87 0 top
H4  50.8,62.87 0 top
HL1  17.53,54.1 180 top
HL2  48.26,54.36 0 top
HL3  1.91,75.69 270 top
HL4  64.14,75.69 270 top
JP3  44.45,17.78 270 top
JP4  21.59,17.78 90 top
JP5  20.32,12.7 90 top
JP6  58.42,36.83 0 top
JP7  7.62,36.83 180 top
R1  17.53,50.55 90 top
R2  30.48,5.08 90 bottom
R3  28.45,5.08 90 bottom
R4  45.47,51.82 0 bottom
R5  27.94,64.01 0 bottom
R6  45.47,53.85 0 bottom
R7  23.88,64.26 0 bottom
R8  27.94,70.61 90 bottom
R9  2.54,72.39 0 bottom
R10  31.24,70.61 270 bottom
R11  23.88,66.29 0 bottom
R12  31.24,64.01 0 bottom
R13  34.8,64.01 0 bottom
R14  42.42,64.26 180 bottom
R15  34.8,70.61 90 bottom
R16  41.4,38.1 270 top
R17  63.5,72.39 180 bottom
R18  38.1,70.61 270 bottom
R19  42.42,66.29 180 bottom
R20  56.64,67.31 0 bottom
R21  56.64,65.28 0 bottom
R22  38.1,63.75 0 bottom
R23  32.51,5.08 90 bottom
R24  23.37,61.72 270 bottom
R25  9.91,33.02 90 bottom
R26  11.94,33.02 270 bottom
R27  9.91,27.94 90 bottom
R28  11.94,27.94 270 bottom
R29  9.91,22.86 90 bottom
R30  11.94,22.86 270 bottom
R31  9.91,17.78 90 bottom
R32  11.94,17.78 270 bottom
R33  9.91,12.7 90 bottom
R34  11.94,12.7 270 bottom
R35  56.13,33.02 90 bottom
R36  54.1,33.02 270 bottom
R37  56.13,27.94 90 bottom
R38  54.1,27.94 270 bottom
R39  56.13,22.86 90 bottom
R40  54.1,22.86 270 bottom
R41  56.13,17.78 90 bottom
R42  54.1,17.78 270 bottom
R43  56.13,12.7 90 bottom
R44  54.1,12.7 270 bottom
R45  24.89,4.57 180 bottom
R46  24.89,6.6 180 bottom
R47  14.48,34.29 0 bottom
R48  14.48,31.75 0 bottom
R49  14.48,29.21 0 bottom
R50  14.48,26.67 0 bottom
R51  14.48,24.13 0 bottom
R52  14.48,21.59 0 bottom
R53  14.48,19.05 0 bottom
R54  14.48,16.51 0 bottom
R55  14.48,13.97 0 bottom
R56  14.48,11.43 0 bottom
R57  51.56,34.29 180 bottom
R58  51.56,31.75 180 bottom
R59  51.56,29.21 180 bottom
R60  51.56,26.67 180 bottom
R61  51.56,24.13 180 bottom
R62  51.56,21.59 180 bottom
R63  51.56,19.05 180 bottom
R64  51.56,16.51 180 bottom
R65  51.56,13.97 180 bottom
R66  51.56,11.43 180 bottom
R67  53.21,55.12 180 bottom
R68  53.09,53.09 180 bottom
R69  53.09,51.05 180 bottom
R70  53.09,49.02 180 bottom
R71  53.09,46.99 180 bottom
R72  53.09,44.45 180 bottom
R73  53.09,41.91 180 bottom
R74  53.09,39.37 180 bottom
R75  12.95,55.12 0 bottom
R76  12.95,53.09 0 bottom
R77  12.95,51.05 0 bottom
R78  12.95,49.02 0 bottom
R79  12.95,46.99 0 bottom
R80  12.95,44.45 0 bottom
R81  12.95,41.91 0 bottom
R82  12.95,39.37 0 bottom
SV1  45.72,44.2 0 top
SV2  45.72,38.1 0 top
U$1  33.02,66.04 0 top
U$2  13.46,75.44 0 top
U$3  36.58,19.81 0 top
VT1  27.94,67.06 0 bottom
VT2  13.97,72.39 0 bottom
VT3  20.32,72.39 0 bottom
VT4  31.24,67.06 0 bottom
VT5  34.8,67.06 0 bottom
VT6  45.72,72.39 0 bottom
VT7  52.07,72.39 0 bottom
VT8  38.1,67.06 0 bottom
X1  33.02,74.93 180 top
X2  24.89,49.53 0 top
X3  7.11,74.93 180 top
X4  58.93,74.93 180 top
X5  39.37,5.08 90 bottom
X6  59.69,66.04 90 top
X7  2.54,66.04 90 top
X8  63.5,66.04 90 top
X9  43.43,29.46 90 top
X10  6.35,66.04 270 top
X11  33.02,11.43 180 top
X12  7.62,22.86 270 top
X13  58.42,22.86 270 top
X14  55.88,48.26 270 top
X15  10.16,48.26 270 top
X16  33.02,57.15 0 top
X17  5.08,22.86 270 top
X18  60.96,22.86 270 top
X19  58.42,48.26 270 top
X20  7.62,48.26 270 top
X21  2.54,22.86 270 top
X22  63.5,22.86 270 top
X23  60.96,48.26 270 top
X24  5.08,48.26 270 top
X25  5.08,5.08 0 top
X26  60.96,5.08 0 top
X27  63.5,48.26 270 top
X28  2.54,48.26 270 top
ZQ1  21.59,37.59 270 top

### Tracks (layer width: path | path; a pad name or v marks a point on that pad's centre or on a via)
!NRST  (via drill 0.4)
  Top 0.2: v38.86,42.93 40.98,42.93 C12.1 42.46,42.29 SV1.3
  Bottom 0.2: DD1.14 29.46,39.11 32.26,41.91 32.26,42.42 33.02,43.18 38.61,43.18 v38.86,42.93
+3V3  (via drill 0.4, 0.8)  (3 unrouted)
  Top 0.2: v30.15,43.11 28.86,43.11 C11.1 | C10.1 v38.86,44.2 | C7.1 v27.18,37.59 | v27.18,33.27 C8.1 | C9.1 v38.61,32.77 38.77,32.61 DD1.75 | SV2.3 43.18,35.02 DD1.75 | DD1.75 40.77,32.13 X9.1
  Top 0.254: 17.53,56.39 HL1.A
  Top 0.406: 33.27,38.61 33.02,38.61 28.96,42.67 28.96,43.18 | 33.27,38.61 33.53,38.61 | 33.53,38.61 33.78,38.61 37.43,42.25 C10.1 | 33.27,38.61 33.53,38.35 35.05,36.83 35.05,34.29 36.41,32.93 C9.1 | C7.1 30.39,37.5 31.24,38.35 33.27,38.35 33.4,38.23 | 29.12,33.44 30.9,33.44 32.51,35.05 32.51,37.59 33.53,38.61 | v16,37.85 16,55.63 16.76,56.39 17.53,56.39 20.07,56.39 v20.83,55.63 | 29.46,7.62 v29.46,2.54
  Top 0.61: 29.97,31.24 33.27,34.54 33.27,38.1 33.4,38.23 33.53,38.35
  Top 0.762: JP7.1 10.16,9.91 12.45,7.62 29.46,7.62 46.23,7.62 v46.74,7.11 47.24,7.62 53.59,7.62 55.88,9.91 JP6.1 | X11.2 v46.74,10.16 46.74,11.43 44.2,13.97 41.66,13.97 34.29,21.34 29.21,21.34 24.38,16.26 20.57,16.26 20.32,16.76 | 20.32,16.76 20.32,16.51 | 20.32,16.76 JP4.2 | 20.07,17.78 20.07,22.86 18.03,24.89 18.03,30.73 18.54,31.24 29.97,31.24
  Bottom 0.2: R2.1 30.81,4.23 | DD1.28 28.02,45.13 29.97,43.18 v30.15,43.11 26.67,43.11 | 26.67,43.11 DD1.22 | DD1.50 39.02,44.35 v38.86,44.2 | DD1.11 27.16,37.61 v27.18,37.59 | DD1.100 27.02,33.12 v27.18,33.27 | DD1.75 38.77,32.61 v38.61,32.77 | DD1.21 26.17,42.61 26.67,43.11
  Bottom 0.406: DD2.3 20.95,55.5 v20.83,55.63 | JP7.1 14.99,36.83 v16,37.85 | R2.1 R3.1 28.45,3.56 v29.46,2.54 | 30.81,4.23 R23.2
  Bottom 0.762: v46.74,7.11 v46.74,10.16
+5V  (2 unrouted)
  Top 0.508: X27.1 63.5,58.93 65.28,60.71 65.28,66.8 64.77,67.31 X8.3 62.23,67.31 X6.4 | X28.1 2.54,59.44 0.76,61.21 0.76,66.55 1.52,67.31 X7.3
  Top 0.61: 2.54,40.64 11.43,40.64 11.43,35.56 | 63.5,40.64 54.61,40.64 54.61,35.56
  Top 0.762: X28.8 2.54,40.64 X28.7 | X27.8 63.5,40.64 X27.7 | 11.43,35.56 11.43,10.16 12.95,8.64 25.15,8.64 | 54.61,17.78 54.61,10.16 53.09,8.64 25.15,8.64 | 54.61,17.78 54.61,35.56 | 54.61,17.78 JP3.2 | X11.14 25.4,8.89 25.15,8.64
  Bottom 0.2: R25.1 9.49,32.17
  Bottom 0.203: R21.2 R20.2 55.79,67.48 58.17,69.85 X6.4
  Bottom 0.305: R26.1 R25.1 9.06,33.02 6.35,33.02 | R28.1 R27.1 9.06,27.94 6.35,27.94 | R29.1 R30.1 | R31.1 R32.1 | R34.1 R33.1 9.06,12.7 6.35,12.7 6.35,17.78 | R36.1 R35.1 56.98,33.02 59.69,33.02 | R38.1 R37.1 56.98,27.94 59.69,27.94 | R40.1 R39.1 56.98,22.86 59.69,22.86 | R42.1 R41.1 56.98,17.78 59.69,17.78 | R44.1 R43.1 56.98,12.7 59.69,12.7 59.69,17.78 | 6.35,27.94 6.35,33.02 | 6.35,17.78 6.35,22.86 | 6.35,22.86 6.35,27.94 | 6.35,22.86 9.14,22.86 9.91,22.1 | 6.35,17.78 9.14,17.78 9.91,17.02 | 59.69,33.02 59.69,27.94 | 59.69,27.94 59.69,22.86 | 59.69,22.86 59.69,17.78 | 59.69,33.02 59.69,37.59 60.2,38.1 62.23,38.1 X27.8 | 6.35,33.02 6.35,37.59 5.84,38.1 3.81,38.1 X28.8
  Bottom 1.016: X28.8 X28.7 X28.6 X28.5 X28.4 X28.3 X28.2 X28.1 | X27.8 X27.7 X27.6 X27.5 X27.4 X27.3 X27.2 X27.1
AG0
  Bottom 0.2: DD1.26 21.46,46.36 14.99,52.83 14.99,53.85 14.39,54.59 | 14.39,54.59 13.97,55.12 | R75.1 13.87,55.12 14.39,54.59
AG0C
  Bottom 0.2: R75.2 12.1,55.21 X15.1
AG1
  Bottom 0.2: DD1.25 22.45,44.61 13.97,53.09 R76.1
AG1C
  Bottom 0.2: R76.2 11.68,53.09 X15.2
AG2
  Bottom 0.2: DD1.24 22.19,44.11 15.24,51.05 R77.1
AG2C
  Bottom 0.2: R77.2 11.18,51.05 X15.3
AG3
  Bottom 0.2: DD1.23 21.92,43.61 16.51,49.02 R78.1
AG3C
  Bottom 0.2: R78.2 10.67,49.02 X15.4
AG4
  Bottom 0.2: DD1.18 24.41,41.13 22.86,42.67 17.53,42.67 13.97,46.23 13.97,46.82 R79.1
AG4C
  Bottom 0.2: X15.5 R79.2
AG5
  Bottom 0.2: DD1.17 24.14,40.63 22.61,42.16 17.27,42.16 14.99,44.45 R80.1
AG5C
  Bottom 0.2: R80.2 X15.6
AG6
  Bottom 0.2: DD1.16 23.88,40.13 22.35,41.66 14.06,41.66 R81.1
AG6C
  Bottom 0.2: X15.7 R81.2
AG7
  Bottom 0.2: DD1.15 23.62,39.63 22.1,41.15 14.99,41.15 13.97,40.13 13.97,39.54 R82.1
AG7C
  Bottom 0.2: R82.2 X15.8
BOOT0  (via drill 0.4)
  Top 0.2: v36.83,39.12 41.24,39.12 R16.1 42.46,40.01 SV2.1
  Bottom 0.2: DD1.94 30.02,32.97 29.21,33.78 29.21,36.58 31.75,39.12 v36.83,39.12
BOOT1  (via drill 0.4)
  Top 0.2: v36.07,54.1 42.16,54.1 v43.43,52.83
  Bottom 0.2: DD1.37 32.52,53.33 33.02,53.85 35.81,53.85 v36.07,54.1 | 44.7,51.9 R4.2 44.62,52.83 | 44.62,52.83 R6.2 | v43.43,52.83 44.62,52.83
CAN_RX  (via drill 0.4)
  Top 0.2: v33.27,40.89 32.26,41.91 32.26,42.42 32.77,42.93 32.77,48.26 27.69,53.09 21.84,53.09 v19.56,55.37
  Bottom 0.2: v33.27,40.89 33.02,41.15 28.7,36.83 28.7,33.53 29.52,32.71 DD1.95 | v19.56,55.37 19.56,53.41 DD2.4
CAN_TX  (via drill 0.4)
  Top 0.2: v33.27,42.16 33.27,48.51 27.94,53.59 25.15,53.59 v23.37,55.37
  Bottom 0.2: v23.37,55.37 23.37,53.41 DD2.1 | DD1.96 29.02,32.45 28.19,33.27 28.19,37.08 v33.27,42.16
CANH
  Bottom 0.2: DD2.7 22.23,62.1 17.53,66.8
  Bottom 0.203: 17.53,66.8 6.86,66.8 X10.2
CANL
  Bottom 0.2: DD2.6 20.95,62.61 17.27,66.29
  Bottom 0.203: 17.27,66.29 7.87,66.29 X10.3
CANRS
  Bottom 0.2: DD2.8 23.5,60.74 R24.2
DAC1
  Bottom 0.2: DD1.29 28.52,48.44 X2.3
DAC2
  Bottom 0.2: DD1.30 29.02,49.21 X2.4
E0F0
  Bottom 0.2: DD1.31 29.52,48.57 29.52,50.24 28.96,50.8 18.8,50.8 15.24,54.36 15.24,55.88 14.48,56.64 12.7,56.64 11.94,57.4 11.94,58.42 11.68,58.67 6.1,58.67 X7.1
E0F1
  Bottom 0.2: DD1.32 30.02,48.31 30.02,50.5 29.21,51.31 19.05,51.31 15.75,54.61 15.75,56.13 14.73,57.15 12.95,57.15 12.45,57.66 12.45,58.67 11.94,59.18 6.35,59.18 3.81,61.72 3.81,63.5 X7.2
E1F0  (via drill 0.5)
  Top 0.203: v51.31,37.34 51.82,37.85 51.82,55.75 55.75,59.69 60.96,59.69 X8.1
  Bottom 0.203: DD1.59 48.02,40.63 v51.31,37.34
E1F1  (via drill 0.5)
  Top 0.203: v49.78,37.34 51.31,38.86 51.31,56.01 55.5,60.2 60.71,60.2 61.98,61.47 61.98,63.25 X8.2
  Bottom 0.203: DD1.60 47,40.13 v49.78,37.34
G0
  Bottom 0.2: DD1.51 47.93,44.63 49.28,45.97 49.28,49.02 50.04,49.78 50.04,50.42 50.55,50.93 50.55,52.2 51.05,52.7 51.05,53.81 R67.1
G0C
  Bottom 0.2: R67.2 54.06,55.33 X14.1
G1
  Bottom 0.2: DD1.52 48.19,44.13 49.78,45.72 49.78,48.77 50.55,49.53 50.55,50.16 51.05,50.67 51.05,51.9 R68.1
G1C
  Bottom 0.2: R68.2 54.36,53.09 X14.2
G2
  Bottom 0.2: DD1.53 48.45,43.63 50.29,45.47 50.29,48.51 51.05,49.28 51.05,49.87 R69.1
G2C
  Bottom 0.2: R69.2 54.86,51.05 X14.3
G3
  Bottom 0.2: DD1.54 48.71,43.13 50.8,45.21 50.8,48.39 51.44,49.02 R70.1
G3C
  Bottom 0.2: R70.2 55.37,49.02 X14.4
G4
  Bottom 0.2: DD1.55 48.98,42.63 51.31,44.96 51.31,46.06 R71.1
G4C
  Bottom 0.2: R71.2 X14.5
G5
  Bottom 0.2: DD1.56 49.24,42.13 51.56,44.45 R72.1
G5C
  Bottom 0.2: R72.2 X14.6
G6
  Bottom 0.2: DD1.57 51.95,41.63 R73.1
G6C
  Bottom 0.2: R73.2 X14.7
G7
  Bottom 0.2: DD1.58 50.48,41.13 R74.1
G7C
  Bottom 0.2: R74.2 X14.8
GND  (via drill 0.4, 0.8)  (11 unrouted)
  Top 0.305: v20.57,37.59 22.1,37.59 v22.86,36.83
  Top 0.508: X24.1 5.08,58.17 4.06,59.18 | X23.1 60.96,58.67 61.47,59.18
  Top 0.61: X21.1 2.54,36.83 X24.8 | X22.1 63.5,36.83 X23.8 | 5.08,45.72 13.97,45.72 | 60.96,45.72 53.34,45.72
  Top 0.813: X24.6 5.08,45.72 X24.5 | X23.6 60.96,45.72 X23.5
  Top 1.778: X22.1 63.5,4.57 | 7.62,4.32 7.11,4.32 2.54,8.89 X21.1
  Bottom 0.2: 27.53,29.9 27.51,29.9 27.51,31.93 | DD1.19 26.36,41.6 | 24.18,42.11 26.36,42.11 | 27.53,45.47 27.53,47.37 | 38.53,45.36 38.53,47.3 38.71,47.47 | 39.73,33.1 41.73,33.1 | 25.27,41.66 24.64,41.66 24.18,42.11 | 23.5,42.8 24.18,42.11
  Bottom 0.305: 22.99,37.11 26.29,37.11 | v22.86,36.83 23.11,37.08 | 19.05,38.35 19.81,38.35 v20.57,37.59 19.81,36.83 19.05,36.83
  Bottom 0.508: 53.85,69.85 56.39,69.85 | 60.96,57.4 60.96,58.67 61.47,59.18 | 5.08,57.4 5.08,58.17 4.06,59.18
  Bottom 1.016: VT2.1 15.88,72.01 17.02,73.15 22.35,73.15 | VT3.1 22.23,73.03 22.35,73.15 | VT7.1 53.98,72.26 53.09,73.15 47.5,73.15 | VT6.1 47.62,73.03 47.5,73.15 | 22.35,73.15 22.99,73.15 C2.- 25.4,75.44 | 47.5,73.15 43.05,73.15 C1.- | 30.99,76.96 31.04,76.91 | X24.8 X24.7 X24.6 X24.5 X24.4 X24.3 X24.2 X24.1 | X23.8 X23.7 X23.6 X23.5 X23.4 X23.3 X23.2 X23.1
  Bottom 1.27: 25.4,75.44 26.92,76.96 30.99,76.96 39.24,76.96 C1.- | 31.04,76.91 X1.2
  Bottom 1.778: X25.2 6.99,4.45 2.54,8.89 X21.10 X21.9 X21.8 X21.7 X21.6 X21.5 X21.4 X21.3 X21.2 X21.1 | X26.2 X22.10 X22.9 X22.8 X22.7 X22.6 X22.5 X22.4 X22.3 X22.2 X22.1
  other vias: 26.67,1.27 39.37,1.27 27.18,34.54 27.18,44.7 34.29,44.2 38.61,34.04 17.78,58.67 25.15,52.2 45.72,61.72 45.72,60.71 55.88,63.5 53.85,66.8 27.18,40.64 38.35,41.4 38.35,40.39 34.54,33.02 34.8,41.91 21.34,19.56 21.34,20.57 27.69,26.92 27.69,24.13 26.67,24.13 25.65,24.13 38.86,24.13 39.88,24.13 38.86,26.92 39.88,26.92 47.75,14.99 47.75,13.97 27.69,16.26 26.67,16.26 15.75,9.91 16.76,9.91 37.08,15.24 38.1,15.24 37.08,16.26 38.86,4.57 34.8,5.08 62.23,58.93 61.21,58.93 17.27,44.45 17.27,45.47 3.56,58.93 4.57,58.93 25.15,20.57 25.15,19.56 32.51,62.48 33.53,62.48 39.37,62.48 40.39,62.48 17.78,57.66 26.16,52.2 43.94,49.4 44.96,49.4 13.28,35.74 30.07,34.37
  pour Bottom (isolate 0.254): 11.43,0 11.43,8.89 10.16,10.16 10.16,34.29 11.43,35.56 11.43,58.42 0,58.42 0,72.39 8.89,72.39 10.16,71.12 10.16,67.31 55.88,67.31 55.88,71.12 57.15,72.39 66.04,72.39 66.04,58.42 54.61,58.42 54.61,35.56 55.88,34.29 55.88,10.16 54.61,8.89 54.61,0
  pour Top (isolate 0.254): 11.43,0 11.43,8.89 10.16,10.16 10.16,34.29 11.43,35.56 11.43,58.42 0,58.42 0,72.39 8.89,72.39 10.16,71.12 55.88,71.12 57.15,72.39 66.04,72.39 66.04,58.42 54.61,58.42 54.61,35.56 55.88,34.29 55.88,10.16 54.61,8.89 54.61,0
GPVCC
  Bottom 1.016: JP6.2 X19.8 X19.7 X19.6 X19.5 X19.4 X19.3 X19.2 X19.1
I2C-SCL/TX
  Bottom 0.203: DD1.47 37.52,47.68 39.37,49.53 39.37,51.56 46.48,58.67 52.32,58.67 58.29,64.64 | 58.29,64.64 58.42,64.77 X6.2 | R21.1 57.66,65.28 58.29,64.64
I2C-SDA/RX
  Bottom 0.203: DD1.48 38.02,47.42 39.88,49.28 39.88,51.31 46.74,58.17 52.58,58.17 57.91,63.5 60.45,63.5 61.21,64.26 61.21,66.55 60.45,67.31 60.2,67.31 X6.3 R20.1
M0C+
  Bottom 0.406: R9.1 6.55,72.39 X3.1
  Bottom 1.27: VT2.8 VT2.7 VT2.6 VT2.5 9.15,74.99 X3.1
M0C+1
  Bottom 0.406: R17.1 62.23,72.39 60.96,73.66 60.96,74.88 X4.1
  Bottom 1.27: VT6.5 VT6.6 45.72,74.99 | VT6.8 VT6.7 45.72,74.99 | X4.1 60.91,75.74 59.18,77.22 46.48,77.22 45.72,76.45 45.72,74.99
M0C-
  Top 0.254: HL3.3 2.97,77.09
  Top 0.406: HL3.2 HL3.3 | 2.97,77.09 X3.2
  Bottom 1.27: X3.2 5.13,75.74 6.6,77.22 19.56,77.22 20.32,76.45 20.32,74.99 | VT3.5 VT3.6 20.32,74.99 | 20.32,74.99 VT3.7 VT3.8
M0C-1
  Top 0.406: HL4.3 HL4.2 59.11,77.09 X4.2
  Bottom 1.27: VT7.5 VT7.6 VT7.7 VT7.8 56.95,74.99 X4.2
M0DIRN
  Bottom 0.2: 31.02,47.78 31.02,51.53 30.99,51.56
  Bottom 0.203: DD1.34 31.02,47.78 | 30.99,51.56 28.19,54.36 28.19,61.47 29.21,62.48 30.57,62.48 R12.1 32.09,65.86 VT4.1
M0DIRP
  Bottom 0.2: 30.52,48.05 30.52,51.27 30.48,51.31
  Bottom 0.203: DD1.33 30.52,48.05 | 30.48,51.31 27.69,54.1 27.69,62.9 R5.1 28.89,64.11 VT1.1
M0PWMN  (via drill 0.4)
  Top 0.203: v37.85,61.47 26.42,61.47 v21.34,66.55 20.83,67.06 v20.83,71.63
  Bottom 0.203: DD1.39 33.52,51.81 34.8,53.09 36.32,53.09 37.85,54.61 v37.85,61.47 | v21.34,66.55 22.77,66.55 R11.2 | VT3.2 20.95,71.75 v20.83,71.63
M0PWMP  (via drill 0.4)
  Top 0.2: v38.86,60.45 37.34,60.45 36.83,60.96 26.16,60.96 22.86,64.26 v21.59,64.26
  Top 0.203: v14.22,71.88 14.22,71.63 v21.59,64.26
  Bottom 0.203: DD1.40 34.02,51.55 35.05,52.58 36.58,52.58 38.35,54.36 38.35,60.45 v38.86,60.45 | v21.59,64.26 R7.2 | VT2.2 14.61,71.5 v14.22,71.88
M1DIRN
  Bottom 0.2: 32.02,47.26 32.02,53.61 32.77,54.36 35.05,54.36 35.81,55.12
  Bottom 0.203: DD1.36 32.02,47.26 | 35.81,55.12 35.81,61.47 36.83,62.48 37.68,62.48 R22.1 | R22.1 38.61,63.92 | VT8.1 39.05,63.85 R22.1
M1DIRP
  Bottom 0.2: 31.52,47.52 31.52,53.87 32.51,54.86 34.8,54.86 35.31,55.37 35.31,63.67
  Bottom 0.203: DD1.35 31.52,47.52 | 35.31,63.67 R13.1 35.65,65.86 VT5.1
M1PWMN
  Bottom 0.203: DD1.41 34.52,51.28 35.31,52.07 37.34,52.07 40.39,55.12 40.39,60.96 42.42,62.99 42.42,65.44 R19.2 48.26,66.29 48.77,66.8 51.56,66.8 52.7,67.94 VT7.2
M1PWMP  (via drill 0.4)
  Top 0.203: v46.23,71.63 46.23,65.79 v44.96,64.52
  Bottom 0.203: DD1.42 35.02,51.02 35.56,51.56 37.59,51.56 40.89,54.86 40.89,60.71 43.18,62.99 43.18,64.17 R14.2 43.52,64.52 v44.96,64.52 | VT6.2 46.35,71.75 v46.23,71.63
MDDIR1  (via drill 0.4)
  Top 0.203: v33.4,52.96 33.02,52.83 30.48,55.37 30.48,57.15 X16.6
  Bottom 0.203: DD1.38 33.02,52.58 v33.4,52.96
MDDIR2  (via drill 0.4)
  Top 0.203: v36.07,50.55 36.07,51.56 X16.5
  Bottom 0.203: DD1.43 35.52,50 v36.07,50.55
MDPWM1  (via drill 0.4)
  Top 0.2: v37.34,50.55 37.34,51.05 33.02,55.37 33.02,59.18 32.51,59.69 27.94,59.69 X16.2
  Bottom 0.2: DD1.44 36.02,49.23 v37.34,50.55
MDPWM2  (via drill 0.4)
  Top 0.2: v37.08,48.77 35.81,48.77 30.48,54.1 28.45,54.1 X16.1
  Bottom 0.2: DD1.45 36.52,48.2 v37.08,48.77
N$1
  Bottom 0.2: R46.1 22.86,6.6 20.32,9.14 20.32,12.7 JP5.3
N$2
  Bottom 0.2: DD1.12 22.38,38.13 21.59,37.34 ZQ1.2
  Bottom 0.203: C5.2 21.55,35.22 ZQ1.2
N$3
  Bottom 0.2: DD1.13 22.33,38.63 21.59,39.37 ZQ1.1
  Bottom 0.203: ZQ1.1 19.09,40.01 C6.2
N$4
  Bottom 1.016: JP7.2 X20.8 X20.7 X20.6 X20.5 X20.4 X20.3 X20.2 X20.1
N$5
  Bottom 0.2: JP5.2 19.05,8.64 23.11,4.57 R45.1
N$6
  Top 0.254: HL1.C R1.2
N$7  (via drill 0.4)
  Top 0.254: v48.26,51.82 HL2.A
  Bottom 0.254: R6.1 46.32,53.76 v48.26,51.82
N$8  (via drill 0.6)
  Top 0.406: v26.42,69.34 24.89,69.34 23.88,70.36 23.88,71.63 22.1,73.41 13.72,73.41 v12.19,71.88
  Bottom 0.406: VT1.3 R8.1 26.84,69.76 v26.42,69.34 | VT2.4 12.06,71.5 v12.19,71.88
N$9  (via drill 0.6)
  Top 0.406: v29.72,68.83 29.21,68.33 24.89,68.33 23.11,70.1 23.11,71.37 21.84,72.64 19.56,72.64 v18.54,71.63
  Bottom 0.406: VT4.3 R10.2 30.65,69.76 v29.72,68.83 | VT3.4 18.41,71.75 v18.54,71.63
N$10  (via drill 0.6)
  Top 0.406: HL3.4 HL3.1 1.78,75.06 v1.78,75.69
  Bottom 0.406: R9.2 1.69,75.6 v1.78,75.69
N$11  (via drill 0.6)
  Top 0.406: v36.32,68.83 42.86,68.83 VT6.4 43.81,71.75 v43.94,71.63
  Bottom 0.406: VT5.3 R15.1 35.14,69.76 v36.32,68.83 | v43.94,71.63 43.94,69.92 VT6.4
N$12  (via drill 0.6)
  Top 0.406: v39.37,69.85 41.91,69.85 42.93,70.87 42.93,72.64 43.43,73.15 48.51,73.15 v50.04,71.63
  Bottom 0.406: VT8.3 R18.2 39.03,69.76 v39.37,69.85 | VT7.4 50.16,71.75 v50.04,71.63
N$13  (via drill 0.6)
  Top 0.406: v64.26,75.69 64.26,75.06 HL4.4 HL4.1
  Bottom 0.406: R17.2 64.35,75.35 v64.26,75.69
RBGP0  (via drill 0.4)
  Top 0.2: v34.04,16.51 34.04,16 30.99,12.95 30.73,12.95 X11.9
  Bottom 0.2: DD1.77 38.52,31.84 38.35,32 35.56,32 35.52,31.96 DD1.83 35.52,28.66 34.54,27.69 34.54,21.59 35.05,21.08 35.05,17.78 v34.04,16.51
RBGP1  (via drill 0.4)
  Top 0.2: v35.31,15.24 35.31,14.99 34.29,13.97 34.29,11.43 X11.8
  Bottom 0.2: DD1.81 36.52,28.14 35.56,27.18 35.56,22.1 36.07,21.59 36.07,16 v35.31,15.24
RBGP2  (via drill 0.4)
  Top 0.2: v35.31,16.51 33.02,14.22 X11.7
  Bottom 0.2: DD1.82 36.02,28.4 35.05,27.43 35.05,21.84 35.56,21.34 35.56,17.27 v35.31,16.51
RBMISO
  Bottom 0.2: DD1.90 32.02,16.24 X11.5
RBMOSI
  Bottom 0.2: DD1.91 31.52,16.53 31.5,16.51 31.5,16 34.29,13.21 34.29,9.65 34.8,9.14 37.08,9.14 X11.4
RBRXD
  Bottom 0.2: R46.2 25.74,6.95 26.67,7.87 26.67,11.43 X11.13
RBSCK
  Bottom 0.2: DD1.89 32.52,16.5 35.05,13.97 35.81,13.97 36.58,13.21 36.58,11.18 X11.6
RBSCL  (via drill 0.4)
  Top 0.2: v31.5,14.73 29.97,14.73 X11.11
  Bottom 0.2: R3.2 28.45,8.64 28.96,9.14 28.96,11.68 X11.11 | DD1.92 31.02,15.21 v31.5,14.73
RBSDA
  Bottom 0.2: R2.2 X11.10 29.46,11.18 29.46,13.21 30.52,14.26 DD1.93
RBTXD
  Bottom 0.2: R45.2 25.74,4.66 26.92,5.84 26.92,7.11 27.94,8.13 X11.12
S00
  Bottom 0.2: DD1.5 23.7,34.63 23.11,34.04 15.58,34.04 R47.1
S00C
  Bottom 0.2: 13.21,34.29 R47.2
  Bottom 0.305: 13.21,34.29 12.7,34.8 9.91,34.8 | 9.91,34.8 8.13,34.8 X12.1 | R25.2 9.91,34.8
S01
  Bottom 0.2: DD1.4 23.97,34.13 23.37,33.53 17.11,33.53 R48.1
S01C
  Bottom 0.2: 13.21,31.75 R48.2
  Bottom 0.305: 13.21,31.75 12.7,31.24 11.94,31.24 | 11.94,31.24 8.13,31.24 X12.2 | 11.94,31.24 R26.2
S02
  Bottom 0.2: DD1.3 24.23,33.63 23.62,33.02 17.53,33.02 16.51,32 16.51,30.39 R49.1
S02C
  Bottom 0.2: 13.21,29.21 R49.2
  Bottom 0.305: 13.21,29.21 12.7,29.72 9.91,29.72 | 9.91,29.72 8.13,29.72 X12.3 | R27.2 9.91,29.72
S03
  Bottom 0.2: DD1.2 24.49,33.13 23.88,32.51 17.78,32.51 17.02,31.75 17.02,28.36 R50.1
S03C
  Bottom 0.2: 13.21,26.67 R50.2
  Bottom 0.305: 13.21,26.67 12.7,26.16 11.94,26.16 | 11.94,26.16 8.13,26.16 X12.4 | 11.94,26.16 R28.2
S04
  Bottom 0.2: DD1.1 24.75,32.63 24.13,32 18.03,32 17.53,31.5 17.53,26.33 R51.1
S04C
  Bottom 0.2: 13.21,24.13 R51.2
  Bottom 0.305: 13.21,24.13 12.7,24.64 9.91,24.64 | 9.91,24.64 8.13,24.64 X12.5 | R29.2 9.91,24.64
S05
  Bottom 0.2: DD1.98 28.02,29.29 22.35,23.62 17.36,23.62 R52.1
S05C
  Bottom 0.2: 13.21,21.59 R52.2
  Bottom 0.305: 13.21,21.59 12.7,21.08 11.94,21.08 | 11.94,21.08 8.13,21.08 X12.6 | 11.94,21.08 R30.2
S06
  Bottom 0.2: DD1.97 28.52,29.03 22.61,23.11 17.78,23.11 16.26,21.59 16.26,19.98 R53.1
S06C
  Bottom 0.2: 13.21,19.05 R53.2
  Bottom 0.305: 13.21,19.05 12.7,19.56 9.91,19.56 | 9.91,19.56 8.13,19.56 X12.7 | R31.2 9.91,19.56
S07  (via drill 0.4)
  Top 0.2: v29.72,20.07 v33.27,20.07
  Bottom 0.2: DD1.88 33.02,20.83 33.27,20.57 v33.27,20.07 | v29.72,20.07 29.21,20.07 26.67,22.61 18.03,22.61 16.76,21.34 16.76,17.95 R54.1
S07C
  Bottom 0.2: 13.21,16.51 R54.2
  Bottom 0.305: 13.21,16.51 12.7,16 11.94,16 | 11.94,16 8.13,16 X12.8 | 11.94,16 R32.2
S08  (via drill 0.4)
  Top 0.2: v29.72,18.8 v33.27,18.8
  Bottom 0.2: DD1.87 33.52,21.09 34.04,20.57 34.04,19.56 v33.27,18.8 | v29.72,18.8 29.46,18.8 26.16,22.1 18.29,22.1 17.27,21.08 17.27,17.78 16.26,16.76 16.26,14.9 R55.1
S08C
  Bottom 0.2: 13.21,13.97 R55.2
  Bottom 0.305: 13.21,13.97 12.7,14.48 9.91,14.48 | 9.91,14.48 8.13,14.48 X12.9 | R33.2 9.91,14.48
S09  (via drill 0.4)
  Top 0.2: v29.72,17.53 v33.27,17.53
  Bottom 0.2: DD1.86 34.02,21.35 34.54,20.83 34.54,18.8 v33.27,17.53 | v29.72,17.53 25.65,21.59 18.54,21.59 17.78,20.83 17.78,17.53 16.76,16.51 16.76,14.73 16.26,14.22 16.26,12.36 R56.1
S09C
  Bottom 0.2: 13.21,11.43 R56.2
  Bottom 0.305: 13.21,11.43 12.7,10.92 11.94,10.92 | 11.94,10.92 8.13,10.92 X12.10 | 11.94,10.92 R34.2
S10
  Bottom 0.2: DD1.61 45.38,39.63 R57.1
S10C
  Bottom 0.2: R57.2 52.83,34.29
  Bottom 0.305: 52.83,34.29 53.34,34.8 56.13,34.8 | 56.13,34.8 57.91,34.8 X13.1 | 56.13,34.8 R35.2
S11
  Bottom 0.2: DD1.62 45.2,39.13 49.53,34.8 49.53,32.93 R58.1
S11C
  Bottom 0.2: R58.2 52.83,31.75
  Bottom 0.305: 52.83,31.75 53.34,31.24 54.1,31.24 | 54.1,31.24 57.91,31.24 X13.2 | 54.1,31.24 R36.2
S12
  Bottom 0.2: DD1.63 44.94,38.63 49.02,34.54 49.02,30.9 R59.1
S12C
  Bottom 0.2: R59.2 52.83,29.21
  Bottom 0.305: 52.83,29.21 53.34,29.72 56.13,29.72 | 56.13,29.72 57.91,29.72 X13.3 | 56.13,29.72 R37.2
S13
  Bottom 0.2: DD1.64 44.68,38.13 48.51,34.29 48.51,28.87 R60.1
S13C
  Bottom 0.2: R60.2 52.83,26.67
  Bottom 0.305: 52.83,26.67 53.34,26.16 54.1,26.16 | 54.1,26.16 57.91,26.16 X13.4 | 54.1,26.16 R38.2
S14
  Bottom 0.2: DD1.65 44.42,37.63 48.01,34.04 48.01,27.94 49.78,26.16 49.78,25.06 R61.1
S14C
  Bottom 0.2: R61.2 52.83,24.13
  Bottom 0.305: 52.83,24.13 53.34,24.64 56.13,24.64 | 56.13,24.64 57.91,24.64 X13.5 | 56.13,24.64 R39.2
S15
  Bottom 0.2: DD1.66 44.15,37.13 47.5,33.78 47.5,27.69 49.28,25.91 49.28,23.03 R62.1
S15C
  Bottom 0.2: R62.2 52.83,21.59
  Bottom 0.305: 52.83,21.59 53.34,21.08 54.1,21.08 | 54.1,21.08 57.91,21.08 X13.6 | 54.1,21.08 R40.2
S16
  Bottom 0.2: DD1.67 43.89,36.63 46.99,33.53 46.99,27.43 48.77,25.65 48.77,20.99 R63.1
S16C
  Bottom 0.2: R63.2 52.83,19.05
  Bottom 0.305: 52.83,19.05 53.34,19.56 56.13,19.56 | 56.13,19.56 57.91,19.56 X13.7 | 56.13,19.56 R41.2
S17
  Bottom 0.2: R64.1 49.78,16.51 49.53,16.76 49.53,19.3 47.75,21.08 38.86,21.08 38.02,21.92 DD1.78
S17C
  Bottom 0.2: R64.2 52.83,16.51
  Bottom 0.305: 52.83,16.51 53.34,16 54.1,16 | 54.1,16 57.91,16 X13.8 | 54.1,16 R42.2
S18
  Bottom 0.2: R65.1 49.78,14.9 49.78,15.75 49.02,16.51 49.02,19.05 47.5,20.57 38.61,20.57 37.52,21.66 DD1.79
S18C
  Bottom 0.2: R65.2 52.83,13.97
  Bottom 0.305: 52.83,13.97 53.34,14.48 56.13,14.48 | 56.13,14.48 57.91,14.48 X13.9 | 56.13,14.48 R43.2
S19
  Bottom 0.2: R66.1 49.28,12.87 49.28,15.49 48.51,16.26 48.51,18.8 47.24,20.07 38.35,20.07 37.02,21.4 DD1.80
S19C
  Bottom 0.2: R66.2 52.83,11.43
  Bottom 0.305: 52.83,11.43 53.34,10.92 54.1,10.92 | 54.1,10.92 57.91,10.92 X13.10 | 54.1,10.92 R44.2
SWCLK
  Bottom 0.2: DD1.76 43.31,30.86 X9.2
SWDIO
  Bottom 0.2: DD1.72 42.6,34.11 X9.4
U2RX  (via drill 0.4)
  Top 0.2: JP5.1 20.32,12.7 18.54,12.7 15.75,15.49 15.75,31.5 17.53,33.27 22.35,33.27 25.65,36.58 30.23,36.58 v30.73,36.07
  Bottom 0.2: DD1.69 31.04,35.61 31.04,35.77 v30.73,36.07
U2TX  (via drill 0.4)
  Top 0.2: JP5.4 18.03,13.97 16.26,15.75 16.26,31.24 17.78,32.77 22.61,32.77 25.91,36.07 29.46,36.07 30.48,35.05 31.24,35.05 31.75,35.56 31.75,36.83 v31.5,37.08
  Bottom 0.2: DD1.68 31.96,36.11 31.96,36.62 v31.5,37.08
USBD+  (via drill 0.4)
  Top 0.2: v40.13,19.05 v40.13,22.1
  Bottom 0.2: DD1.71 44.39,34.61 45.72,33.27 45.72,29.21 42.67,26.16 42.67,24.13 41.66,23.11 41.15,23.11 v40.13,22.1 | v40.13,19.05 40.89,18.29 40.89,15.49 39.12,13.72 39.12,9.4 39.37,9.14 X5.D+ 39.37,5.84 39.88,5.33 39.88,4.32 39.28,3.72
  Bottom 0.203: 39.28,3.72 33.02,3.72 R23.1
USBD-  (via drill 0.4)
  Top 0.2: v41.4,19.05 v41.4,22.1
  Bottom 0.2: DD1.70 44.65,35.11 46.23,33.53 46.23,28.96 43.18,25.91 43.18,23.88 v41.4,22.1 | v41.4,19.05 41.4,15.24 39.62,13.46 39.62,9.65 40.17,9.11 X5.D-
VMD
  Bottom 0.406: 38.1,73.15 R18.1 | R15.2 34.8,72.9 35.05,73.15 | R10.1 31.24,72.9 31.5,73.15 | 27.94,73.15 R8.2
  Bottom 1.016: VT2.3 13.34,67.94 13.46,67.82 19.81,67.82 | VT3.3 19.68,67.94 19.81,67.82 | 19.81,67.82 22.86,67.82 25.15,70.1 25.15,71.75 C2.+ | 44.96,67.82 43.18,67.82 40.89,70.1 40.89,71.75 C1.+ 40.64,71.88 | 44.96,67.82 51.05,67.82 51.44,68.2 VT7.3 | VT6.3 45.09,67.94 44.96,67.82 | 35.05,73.15 35,73.2
  Bottom 1.27: 40.64,71.88 39.37,73.15 38.1,73.15 35.05,73.15 31.5,73.15 27.94,73.15 26.54,73.15 C2.+ | 35,73.2 X1.1
VREG5
  Top 0.762: DA1.2 42.67,25.4 C3.+ 43.18,19.81 JP3.1
  Bottom 0.305: C14.1 47.16,22.64 46.86,22.35 C3.+
VREG33
  Top 0.762: DA2.2 20.83,25.4 C4.+ 22.86,23.37 JP4.1
  Bottom 0.305: C13.1 22.1,26.67 21.34,25.91 C4.+
VS0
  Top 1.778: 2.54,4.57 2.54,3.81 5.08,1.27 8.89,1.27 10.16,2.54 10.16,6.35 8.89,7.62 7.62,7.62 5.08,10.16 X17.1
  Bottom 1.778: X25.1 2.54,3.81 5.08,1.27 8.89,1.27 10.16,2.54 10.16,6.35 8.89,7.62 7.62,7.62 5.08,10.16 X17.10 X17.9 X17.8 X17.7 X17.6 X17.5 X17.4 X17.3 X17.2 X17.1 JP7.3
VS1  (via drill 0.8)
  Top 0.762: DA2.3 29.79,27.69 32,27.69 34.06,23.09 DA1.3 36.5,22.86 36.83,22.86 36.83,20.32 42.16,14.99 44.7,14.99 v48.26,11.43
  Top 1.778: 58.42,4.32 58.42,5.08 60.96,7.62 X18.1
  Bottom 0.762: 58.42,5.08 55.37,5.08 51.56,8.89 49.78,8.89 48.26,10.41 v48.26,11.43
  Bottom 1.778: X26.1 58.42,5.08 60.96,7.62 X18.10 X18.9 X18.8 X18.7 X18.6 X18.5 X18.4 X18.3 X18.2 X18.1 JP6.3

### Text on the board
Silkscreen: 2011 | OPEN | Rev. 1 | ROBOTICS | M0 | M1 | roboforum.ru | - | + | GND | open-robotics.ru | H | +5V | L | SDA | GND | SCL | GND | E0 | CAN | I2C | E1 | A0 | D0 | A1 | D1 | A2 | RoboMD2 | USER | D2 | A3 | RESET | D3 | POWER | DAC | A4 | D4 | A5 | D5 | A6 | BOOT0 | D6 | A7 | D7 | S00 | S10 | S01 | S11 | SWD | S02 | S12 | S03 | S13 | S04 | S14 | S05 | OR-STM32F1-DS | S15 | +3.3V | S06 | S16 | MASTER | SLAVE | S07 | S17 | +5V | S08 | S18 | S09 | S19 | UART | + | - | - | + | + | -